# Altium schematic sheet Power.SchDoc
size A4
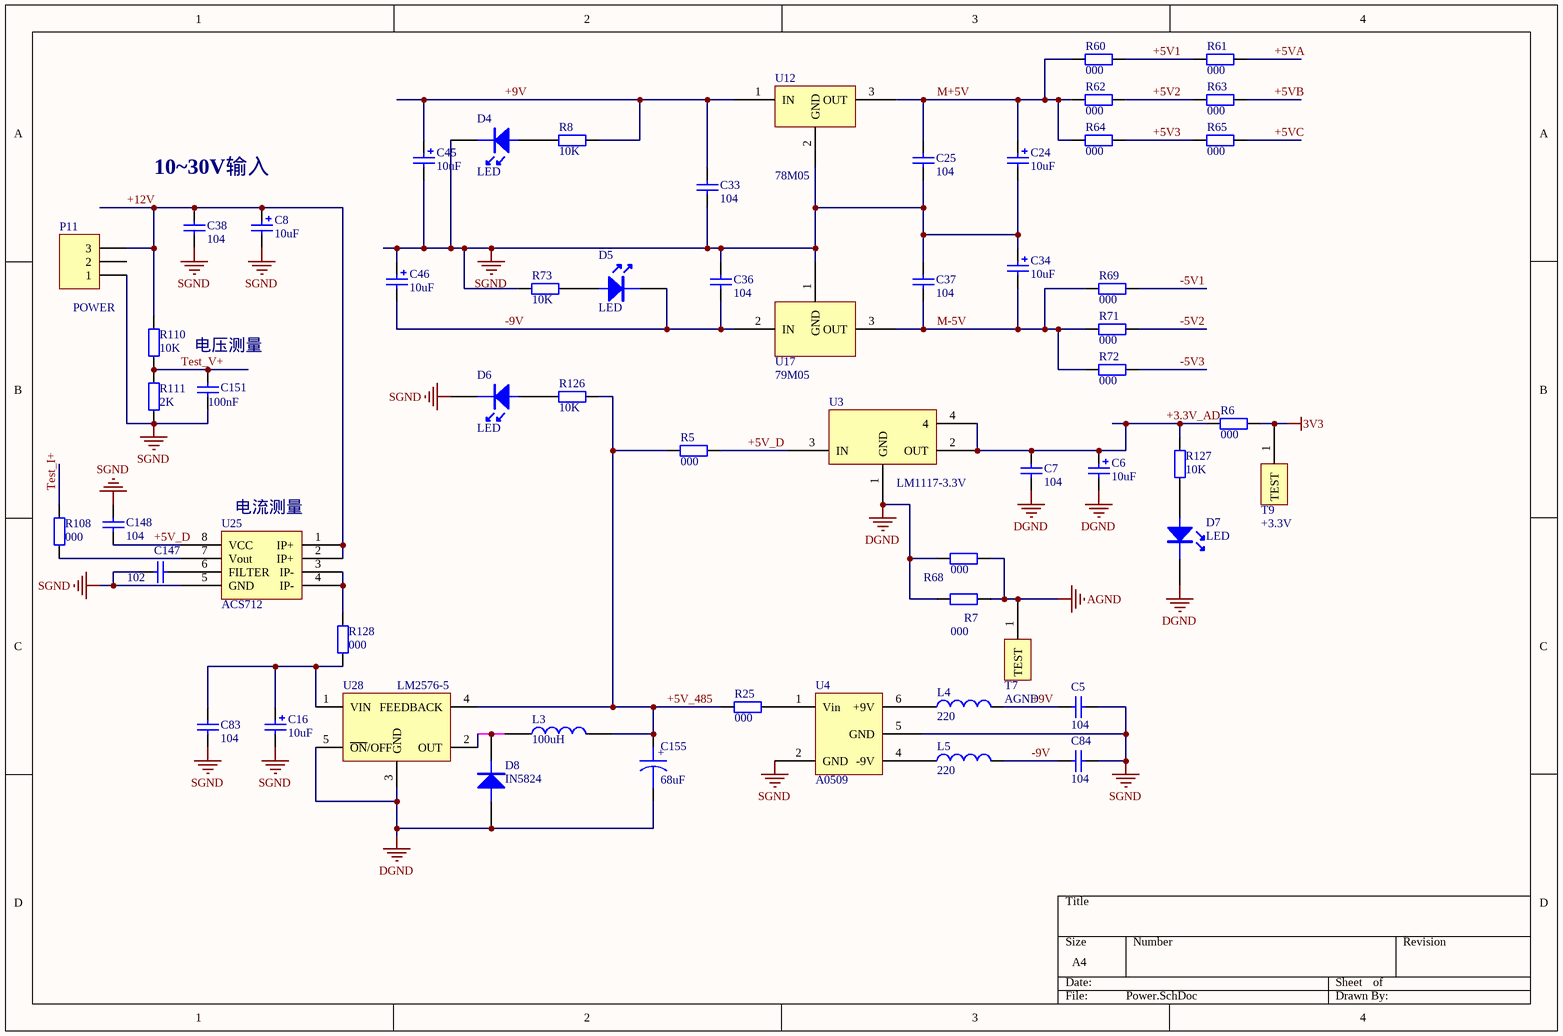
[diagram p0: Power.SchDoc]

## Parts
C5  104  [0805C]
C6  10uF  [C68uF]
C7  104  [0805C]
C8  10uF  [C68uF]
C16  10uF  [C68uF]
C24  10uF  [C68uF]
C25  104  [0805C]
C33  104  [0805C]
C34  10uF  [C68uF]
C36  104  [0805C]
C37  104  [0805C]
C38  104  [0805C]
C45  10uF  [C68uF]
C46  10uF  [C68uF]
C83  104  [0805C]
C84  104  [0805C]
C147  102  [0603]
C148  104  [0603]
C151  value 100nF  [0603]  (hidden comment: Cap)
C155  68uF  [C68uF]
D4  LED  [0805_LED]
D5  LED  [0805_LED]
D6  LED  [0805_LED]
D7  LED  [0805_LED]
D8  IN5824  [1N5824]
L3  100uH  [L100uH]
L4  220  [1206]
L5  220  [1206]
P11  POWER  [SIP3-5.08mm]
R5  000  [0805R]
R6  000  [0805R]
R7  000  [I_ON]
R8  value 10K  [0603]  (hidden comment: Res2)
R25  000  [0805R]
R60  000  [0805R]
R61  000  [0805R]
R62  000  [0805R]
R63  000  [0805R]
R64  000  [0805R]
R65  000  [0805R]
R68  000  [I_ON]
R69  000  [0805R]
R71  000  [0805R]
R72  000  [0805R]
R73  value 10K  [0603]  (hidden comment: Res2)
R108  000  [0603]  (net tie, no BOM)
R110  value 10K  [0603]  (hidden comment: Res2)
R111  value 2K  [0603]  (hidden comment: Res2)
R126  value 10K  [0603]  (hidden comment: Res2)
R127  value 10K  [0603]  (hidden comment: Res2)
R128  000  [0805R]
T7  AGND  [TEST]
T9  +3.3V  [TEST]
U3  LM1117-3.3V  [SOT223]
U4  A0509  [A0509S]
U12  78M05  [7XM05]
U17  79M05  [7XM05]
U25  ACS712  [SO8]
U28  LM2576-5  [lm2596]

## Nets
3V3: R6.1 T9.1(TEST)
AGND: R7.1 R68.1 T7.1(TEST)
DGND: C6.2 C7.2 C155.2 D7.2(K) D8.1(A) R7.2 R68.2 U3.1(GND) U28.3(GND) U28.5(~{ON}/OFF)
SGND: C5.2 C8.2 C16.2 C24.2 C25.2 C33.2 C34.1 C36.1 C37.1 C38.2 C45.2 C46.1 C83.2 C84.2 C147.1 C148.1 C151.1 D4.2(K) D6.2(K) P11.1 R73.2 R111.2 U4.2(GND) U4.5(GND) U12.2(GND) U17.1(GND) U25.5(GND)
+3.3V_AD: C6.1 C7.1 R6.2 R127.2 U3.2(OUT) U3.4
+5V1: R60.1 R61.2
+5V2: R62.1 R63.2
+5V3: R64.1 R65.2
+5V_485: C155.1 L3.2 R5.2 R25.2 R126.2 U28.4(FEEDBACK)
+5V_D: C148.2 R5.1 U3.3(IN) U25.8(VCC)
+5VA: R61.1
+5VB: R63.1
+5VC: R65.1
+9V: C5.1 C33.1 C45.1 L4.2 R8.2 U12.1(IN)
+12V: C8.1 C38.1 P11.3 R110.2 U25.1(IP+) U25.2(IP+)
-5V1: R69.1
-5V2: R71.1
-5V3: R72.1
-9V: C36.2 C46.2 C84.1 D5.2(K) L5.2 U17.2(IN)
M+5V: C24.1 C25.1 R60.2 R62.2 R64.2 U12.3(OUT)
M-5V: C34.2 C37.2 R69.2 R71.2 R72.2 U17.3(OUT)
Test_I+: R108.1
Test_V+: C151.2 R110.1 R111.1
NetC16_1: C16.1 C83.1 R128.2 U28.1(VIN)
NetC147_2: C147.2 U25.6(FILTER)
NetD4_1: D4.1(A) R8.1
NetD5_1: D5.1(A) R73.1
NetD6_1: D6.1(A) R126.1
NetD7_1: D7.1(A) R127.1
NetD8_2: D8.2(K) L3.1 U28.2(OUT)
NetL4_1: L4.1 U4.6(+9V)
NetL5_1: L5.1 U4.4(-9V)
NetR25_1: R25.1 U4.1(Vin)
NetR108_2: R108.2 U25.7(Vout)
NetR128_1: R128.1 U25.3(IP-) U25.4(IP-)

Not connected (* = marked no-connect by the designer): P11 2

## Notes on the sheet
- 10~30V输入
- 电压测量
- (near U25) 电流测量
- (in symbol CAPACITOR POL) +

## Library data of the parts
C5 C7 C25 C33 C36-C38 C83 C84 C147 C148 = Cap: Capacitor; Value: 100nF; Published: 8-Jun-2000; LatestRevisionDate: 17-Jul-2002; LatestRevisionNote: Re-released for DXP Platform.; PackageReference: RAD-0.3; Publisher: Altium Limited
C6 C8 C16 C24 C34 C45 C46 = Cap Pol2: Polarized Capacitor (Axial); Value: 100pF; Published: 8-Jun-2000; LatestRevisionDate: 17-Jul-2002; LatestRevisionNote: Re-released for DXP Platform.; PackageReference: POLAR0.8; Publisher: Altium Limited
C151 = Cap: Capacitor; Published: 8-Jun-2000; LatestRevisionDate: 17-Jul-2002; LatestRevisionNote: Re-released for DXP Platform.; PackageReference: RAD-0.3; Publisher: Altium Limited
C155 = CAPACITOR POL: Capacitor
D8 = DIODE
L3 = INDUCTOR
L4 L5 = Inductor: Code_IEC: 1005; Value: 10mH; Published: 8-Jun-2000; LatestRevisionDate: 29-May-2009; LatestRevisionNote: IPC-7351 Footprint Added.; PackageReference: 0402-A; Publisher: Altium Limited; PackageDescription: Chip Inductor; Code_JEITA: 0402
P11 = Header 3: Header, 3-Pin; LatestRevisionDate: 17-Jul-2002; LatestRevisionNote: Re-released for DXP Platform.; Publisher: Altium Limited
R5-R7 R25 R60-R65 R68 R69 R71 R72 R108 R128 = Res2: Resistor; Value: 1K; Published: 8-Jun-2000; LatestRevisionDate: 17-Jul-2002; LatestRevisionNote: Re-released for DXP Platform.; PackageReference: AXIAL-0.4; Publisher: Altium Limited
R8 R73 R110 R111 R126 R127 = Res2: Resistor; Published: 8-Jun-2000; LatestRevisionDate: 17-Jul-2002; LatestRevisionNote: Re-released for DXP Platform.; PackageReference: AXIAL-0.4; Publisher: Altium Limited
T7 T9 = TEST
U12 = 78M05G
U17 = 79L05
U28 = LM2596-5